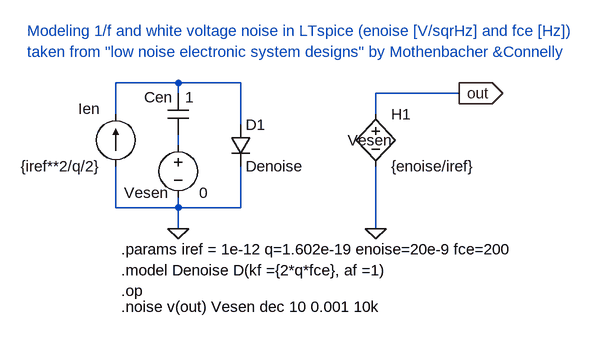
[diagram p0: schematic flickernoise2a.asc]
flickernoise2a.asc, the LTspice schematic file:
Version 4
SHEET 1 880 680
WIRE -64 176 -64 128
WIRE -64 320 -64 256
WIRE 32 128 -64 128
WIRE 32 144 32 128
WIRE 32 224 32 208
WIRE 32 320 -64 320
WIRE 32 320 32 304
WIRE 32 352 32 320
WIRE 128 128 32 128
WIRE 128 192 128 128
WIRE 128 320 32 320
WIRE 128 320 128 256
WIRE 336 176 336 144
WIRE 336 352 336 256
WIRE 464 144 336 144
FLAG 32 352 0
FLAG 336 352 0
FLAG 464 144 out
IOPIN 464 144 Out
SYMBOL diode 112 192 R0
SYMATTR InstName D1
SYMATTR Value Denoise
SYMBOL h 336 160 R0
WINDOW 38 -43 56 Left 0
SYMATTR InstName H1
SYMATTR Value {enoise/iref}
SYMATTR SpiceModel Vesen
SYMBOL current -64 256 R180
WINDOW 0 24 88 Left 0
WINDOW 3 24 0 Left 0
WINDOW 123 0 0 Left 0
WINDOW 39 0 0 Left 0
SYMATTR InstName Ien
SYMATTR Value {iref**2/q/2}
SYMBOL cap 16 144 R0
WINDOW 0 -36 6 Left 0
WINDOW 3 27 6 Left 0
SYMATTR InstName Cen
SYMATTR Value 1
SYMBOL voltage 32 208 R0
WINDOW 0 -83 89 Left 0
WINDOW 3 32 89 Left 0
WINDOW 123 0 0 Left 0
WINDOW 39 0 0 Left 0
SYMATTR InstName Vesen
SYMATTR Value 0
TEXT -56 416 Left 0 !.model Denoise D(kf ={2*q*fce}, af =1)
TEXT -56 472 Left 0 !.noise v(out) Vesen dec 10 0.001 10k
TEXT -56 448 Left 0 !.op
TEXT -56 384 Left 0 !.params iref = 1e-12 q=1.602e-19 enoise=20e-9 fce=200
TEXT -200 80 Left 0 ;taken from "low noise electronic system designs" by Mothenbacher &Connelly
TEXT -200 48 Left 0 ;Modeling 1/f and white voltage noise in LTspice (enoise [V/sqrHz] and fce [Hz])

The netlist it stands for:
* flickernoise2a.asc
D1 N001 0 Denoise
H1 out 0 Vesen {enoise/iref}
Ien 0 N001 {iref**2/q/2}
Cen N001 N002 1
Vesen N002 0 0
.model D D
.lib standard.dio
.model Denoise D(kf ={2*q*fce}, af =1)
.noise v(out) Vesen dec 10 0.001 10k
.op
.params iref = 1e-12 q=1.602e-19 enoise=20e-9 fce=200
* taken from "low noise electronic system designs" by Mothenbacher &Connelly
* Modeling 1/f and white voltage noise in LTspice (enoise [V/sqrHz] and fce [Hz])
.backanno
.end